# EAGLE design ttl-nixie-clock-generator (EAGLE 7.3.0)
CNAME: random_hw; CREVISION: v0.1; DESIGNER: nalajcie
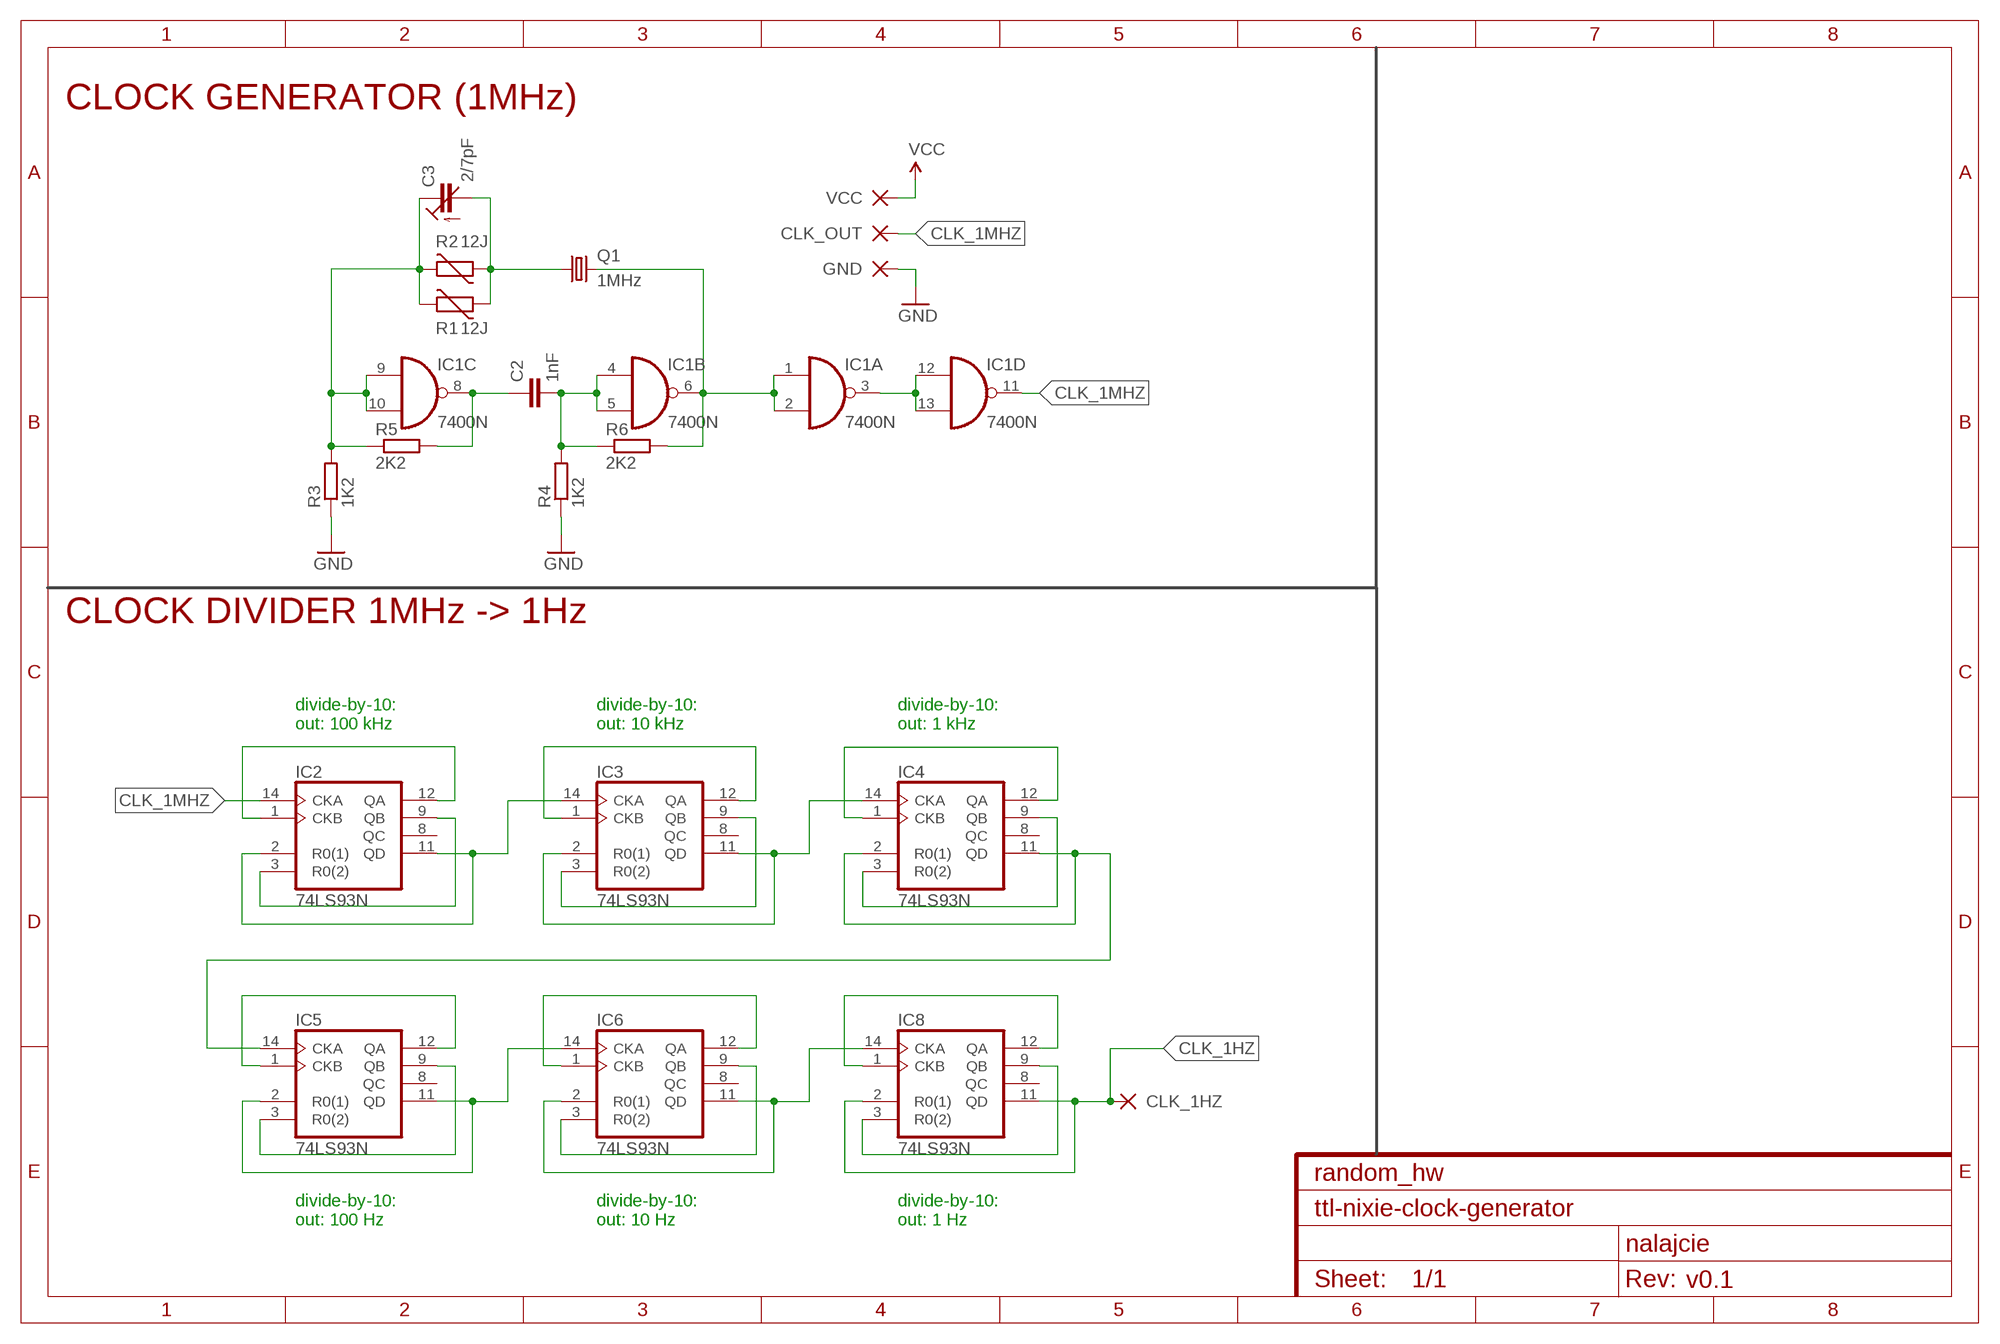
[diagram p0: schematic, sheet 1]

## Parts
C2  1nF  C15/5  [C15B5]
C3  2/7pF  C-TRIMM808-7.5  [CTRIM808-BC7.5]
CLK_1HZ  VCC  2,15/1,0  [2,15/1,0]
CLK_OUT  CLK_OUT  2,15/1,0  [2,15/1,0]
GND  GND  2,15/1,0  [2,15/1,0]
IC1  7400N  [DIL14]
IC2  74LS93N  [DIL14]
IC3  74LS93N  [DIL14]
IC4  74LS93N  [DIL14]
IC5  74LS93N  [DIL14]
IC6  74LS93N  [DIL14]
IC8  74LS93N  [DIL14]
Q1  1MHz  CRYSTALHC33U-V  [HC33U-V]
R1  12J  VARISTOR-7,5  [R-7,5]
R2  12J  VARISTOR-7,5  [R-7,5]
R3  1K2  R-EU_0207/12  [0207/12]
R4  1K2  R-EU_0207/12  [0207/12]
R5  2K2  R-EU_0207/12  [0207/12]
R6  2K2  R-EU_0207/12  [0207/12]
VCC  VCC  2,15/1,0  [2,15/1,0]

## Nets
CLK_1HZ: CLK_1HZ.1(P) IC8.2(R0(1)) IC8.11(QD)
CLK_1MHZ: CLK_OUT.1(P) IC1.11(D:O) IC2.14(CKA)
GND: GND.1(P) R3.1 R4.1
N$1: C3.2(A) Q1.1 R1.1 R2.1
N$2: C3.1(E) IC1.9(C:I0) IC1.10(C:I1) R1.2 R2.2 R3.2 R5.1
N$3: IC1.3(A:O) IC1.12(D:I0) IC1.13(D:I1)
N$4: C2.1 IC1.8(C:O) R5.2
N$5: C2.2 IC1.4(B:I0) IC1.5(B:I1) R4.2 R6.1
N$6: IC1.1(A:I0) IC1.2(A:I1) IC1.6(B:O) Q1.2 R6.2
N$8: IC5.1(CKB) IC5.12(QA)
N$9: IC5.3(R0(2)) IC5.9(QB)
N$10: IC5.2(R0(1)) IC5.11(QD) IC6.14(CKA)
N$11: IC6.1(CKB) IC6.12(QA)
N$12: IC6.3(R0(2)) IC6.9(QB)
N$13: IC6.2(R0(1)) IC6.11(QD) IC8.14(CKA)
N$14: IC8.1(CKB) IC8.12(QA)
N$15: IC8.3(R0(2)) IC8.9(QB)
N$16: IC2.1(CKB) IC2.12(QA)
N$17: IC2.2(R0(1)) IC2.11(QD) IC3.14(CKA)
N$18: IC2.3(R0(2)) IC2.9(QB)
N$19: IC3.3(R0(2)) IC3.9(QB)
N$20: IC3.2(R0(1)) IC3.11(QD) IC4.14(CKA)
N$21: IC3.1(CKB) IC3.12(QA)
N$22: IC4.1(CKB) IC4.12(QA)
N$23: IC4.3(R0(2)) IC4.9(QB)
N$24: IC4.2(R0(1)) IC4.11(QD) IC5.14(CKA)
VCC: VCC.1(P)
Unconnected: IC2.8(QC) IC3.8(QC) IC4.8(QC) IC5.8(QC) IC6.8(QC) IC8.8(QC)

## Notes on the sheet
- CLOCK GENERATOR (1MHz)
- CLOCK DIVIDER 1MHz -> 1Hz
- divide-by-10:
  out: 100 kHz
- divide-by-10:
  out: 10 kHz
- divide-by-10:
  out: 1 kHz
- divide-by-10:
  out: 100 Hz
- divide-by-10:
  out: 10 Hz
- divide-by-10:
  out: 1 Hz

## Power pins joined to a net without a drawn wire
GND: IC1.7(P:GND) IC2.10(GND) IC3.10(GND) IC4.10(GND) IC5.10(GND) IC6.10(GND) IC8.10(GND)
VCC: IC1.14(P:VCC) IC2.5(VCC) IC3.5(VCC) IC4.5(VCC) IC5.5(VCC) IC6.5(VCC) IC8.5(VCC)

## Library data of the parts
C2 = capacitor-wima:C: CAPACITOR naming: grid - package width
C3 = resistor:C-TRIMM: Trimm capacitor
CLK_1HZ CLK_OUT GND VCC = wirepad:2,15/1,0: THROUGH-HOLE PAD
IC1 = 74xx-eu:74*00: Quad 2-input NAND gate
IC2-IC6 IC8 = 74xx-eu:74*93: Decade, divide by twelve and binary COUNTER
Q1 = crystal:CRYSTAL: CRYSTAL; OC_FARNELL: unknown; OC_NEWARK: unknown
R1 R2 = varistor:VARISTOR: VARISTOR
R3-R6 = resistor:R-EU_: RESISTOR, European symbol

## Board
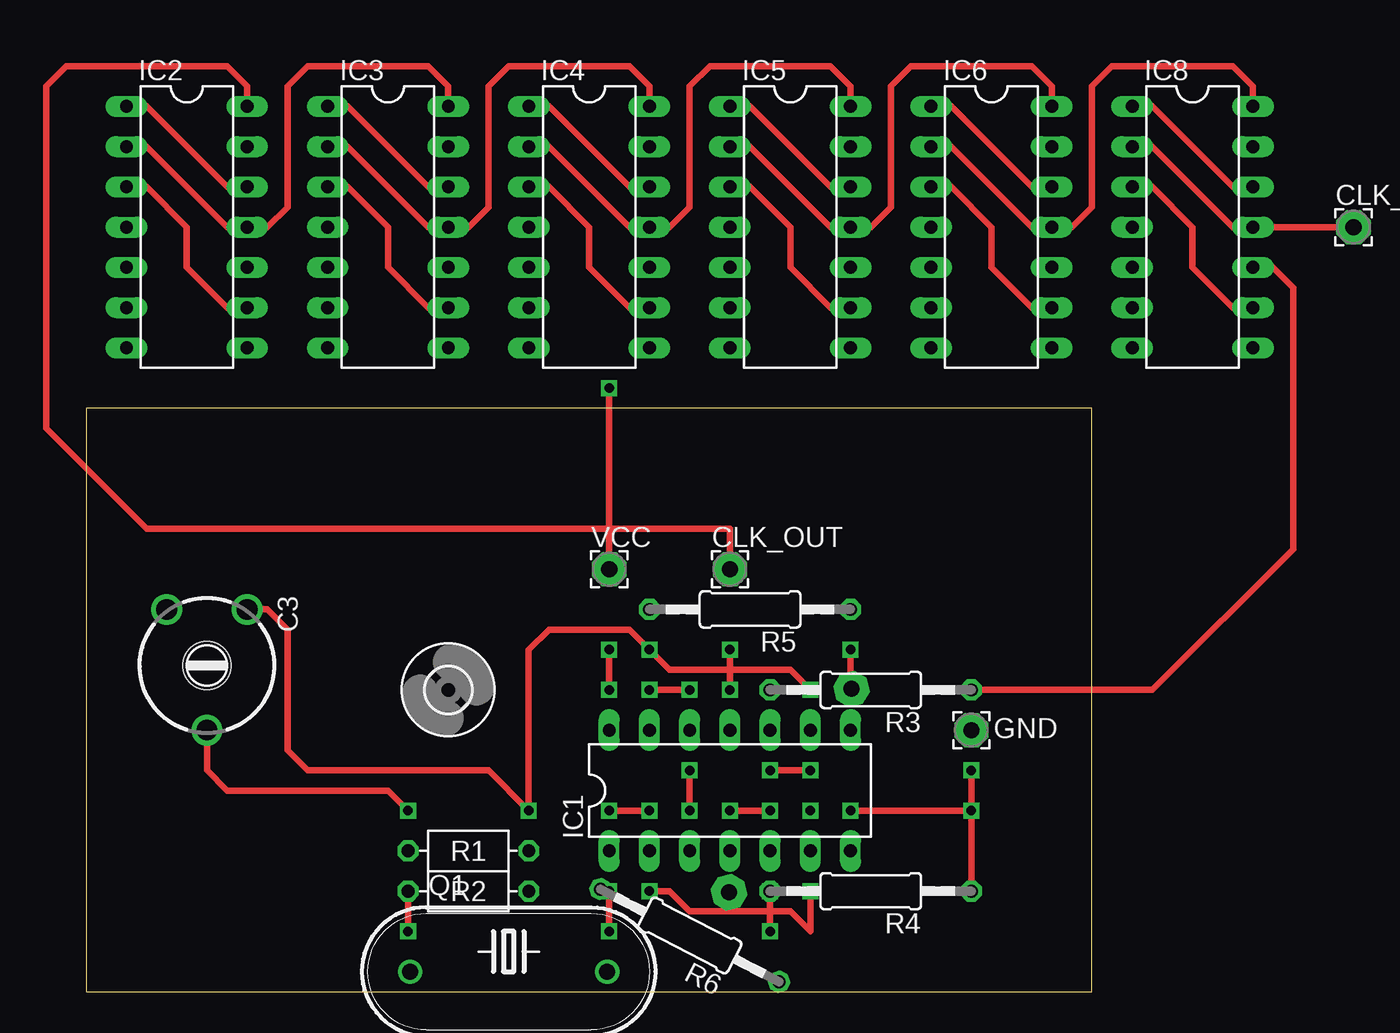
[diagram p1: board, top side]
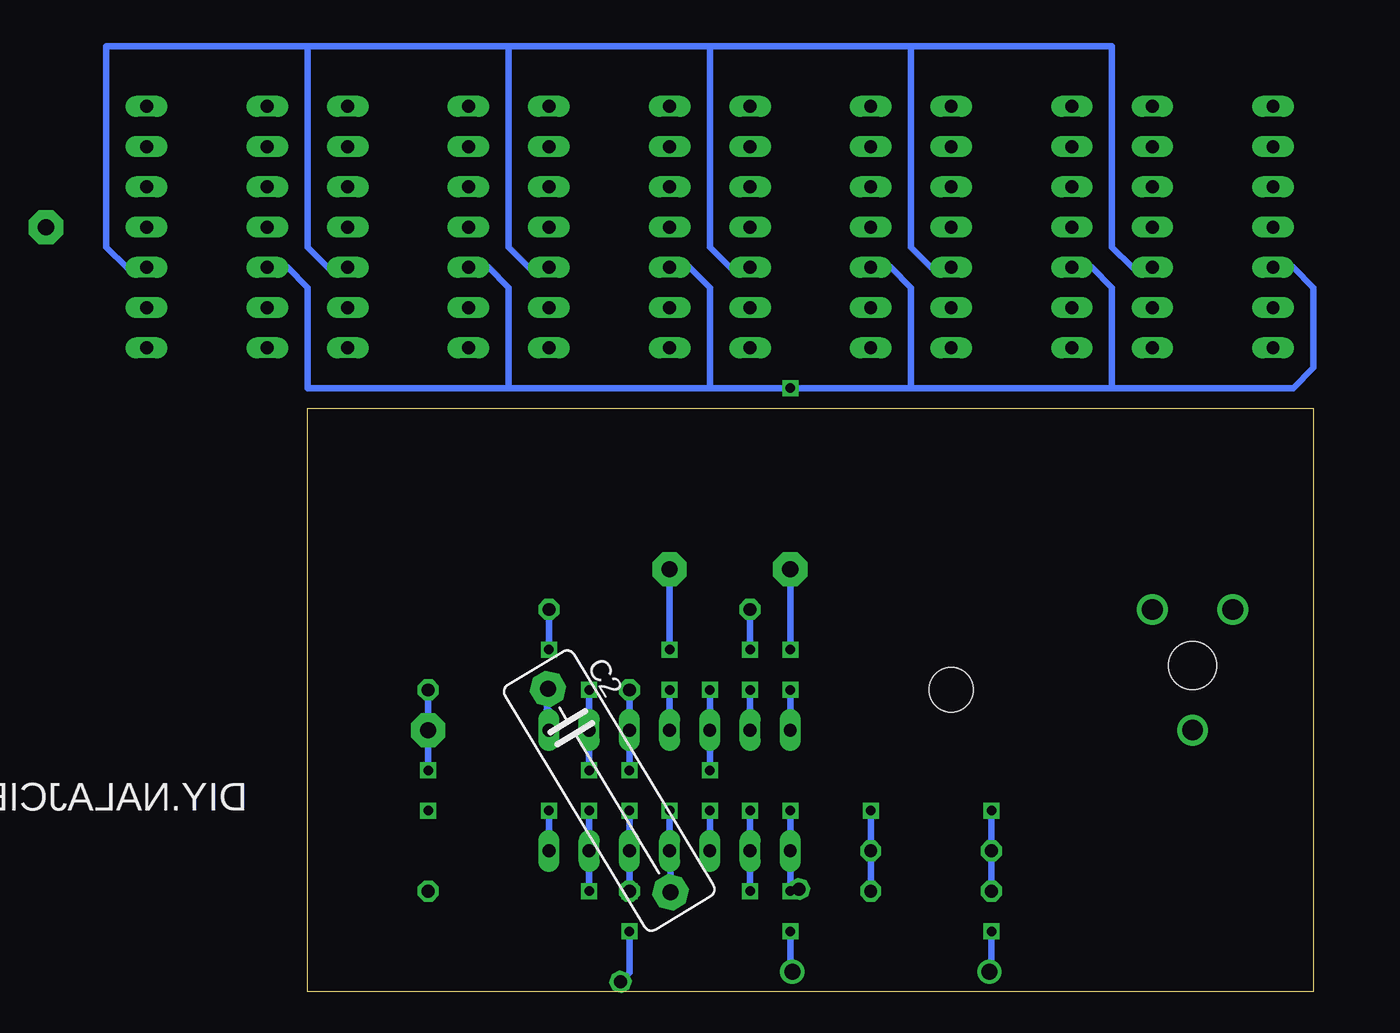
[diagram p2: board, bottom side, seen from below]

Size 63.5 x 36.83 mm. Coordinates in mm from the lower left corner, seen from the top.
Outline: 0,0 63.5,0 63.5,36.83 0,36.82 0,0
Copper layers (1*16): Top 0.035mm / dielectric 1.5mm / Bottom 0.035mm
Design rules "default": minimum track width 10mil, minimum drill 24mil, track to track 8mil, track to pad 8mil, pad to pad 8mil, via to via 8mil, smd to smd 8mil, copper to edge 40mil, drill to drill 8mil, minimum pad ring 10mil, minimum via ring 8mil, stop-mask expansion 4mil, vias tented up to drill 0mil, thermal gap 10mil

### Footprints (pad centres in the part's own frame; a part is rotated, then mirrored left to right if it is on the bottom)
C15B5 = drill 1.016 pad 2.159 octagon: 1 -7.493,0; 2 7.493,0
CTRIM808-BC7.5 = drill 1.3: 1 -2.54,-2.54; 2 0,5.08; 3 2.54,-2.54 | hole 3: 0,1
2,15/1,0 = drill 1.016 pad 2.159 octagon: 1 0,0
DIL14 = drill 0.813 long: 1 -7.62,-3.81; 2 -5.08,-3.81; 3 -2.54,-3.81; 4 0,-3.81; 5 2.54,-3.81; 6 5.08,-3.81; 7 7.62,-3.81; 8 7.62,3.81; 9 5.08,3.81; 10 2.54,3.81; 11 0,3.81; 12 -2.54,3.81; 13 -5.08,3.81; 14 -7.62,3.81
HC33U-V = drill 1.016: 1 -6.223,0; 2 6.223,0
R-7,5 = drill 0.813 octagon: 1 -3.81,0; 2 3.81,0
0207/12 = drill 0.813 octagon: 1 -6.35,0; 2 6.35,0
2,8 = hole 2.8: 0,0

### Placement (x,y rotation side)
C2  44.45,12.7 301.1 bottom
C3  7.62,21.59 180 top
CLK_1HZ  80.01,48.26 0 top  (outside the outline)
CLK_OUT  40.64,26.67 0 top
GND  55.88,16.51 0 top
IC1  40.64,12.7 0 top
IC2  6.35,48.26 270 top  (outside the outline)
IC3  19.05,48.26 270 top  (outside the outline)
IC4  31.75,48.26 270 top  (outside the outline)
IC5  44.45,48.26 270 top  (outside the outline)
IC6  57.15,48.26 270 top  (outside the outline)
IC8  69.85,48.26 270 top  (outside the outline)
Q1  26.67,1.27 0 top
R1  24.13,8.89 0 top
R2  24.13,6.35 0 top
R3  49.53,19.05 180 top
R4  49.53,6.35 180 top
R5  41.91,24.13 0 top
R6  38.1,3.56 152.6 top
U$1  [2,8]  22.86,19.05 0 top
VCC  33.02,26.67 0 top

### Tracks (layer width: path | path; a pad name or v marks a point on that pad's centre or on a via)
CLK_1HZ
  Top 0.406: IC8.2 67.31,53.34 72.39,48.26 IC8.11 CLK_1HZ.1
CLK_1MHZ  (via drill 0.6)
  Top 0.406: v40.64,19.05 v40.64,21.59 | CLK_OUT.1 40.64,29.21 3.81,29.21 -2.54,35.56 -2.54,57.15 -1.27,58.42 8.89,58.42 10.16,57.15 IC2.14
  Bottom 0.406: v40.64,21.59 CLK_OUT.1 | v40.64,19.05 IC1.11
GND  (via drill 0.6)
  Top 0.406: v55.88,11.43 v55.88,13.97 | R4.1 v55.88,11.43 | v55.88,11.43 v48.26,11.43 | R3.1 67.31,19.05 76.2,27.94 76.2,44.45 74.93,45.72 IC8.10
  Bottom 0.406: R3.1 GND.1 v55.88,13.97 | v48.26,11.43 IC1.7 | IC2.10 11.43,45.72 12.7,46.99 12.7,59.69 25.4,59.69 | 25.4,59.69 25.4,46.99 24.13,45.72 IC3.10 | IC4.10 36.83,45.72 38.1,46.99 38.1,59.69 | 38.1,59.69 25.4,59.69 | IC5.10 49.53,45.72 50.8,46.99 50.8,59.69 | 50.8,59.69 38.1,59.69 | IC6.10 62.23,45.72 63.5,46.99 63.5,59.69 | 63.5,59.69 50.8,59.69 | IC8.10 74.93,45.72 76.2,46.99 76.2,59.69 63.5,59.69
N$1  (via drill 0.6)
  Top 0.406: v20.32,3.81 R2.1 | v20.32,11.43 19.05,12.7 8.89,12.7 7.62,13.97 C3.2
  Bottom 0.406: Q1.1 20.32,1.4 v20.32,3.81 | R2.1 R1.1 v20.32,11.43
N$2  (via drill 0.6)
  Top 0.406: v43.18,13.97 v45.72,13.97 | v45.72,19.05 44.45,20.32 36.83,20.32 v35.56,21.59 34.29,22.86 29.21,22.86 27.94,21.59 v27.94,11.43 25.4,13.97 13.97,13.97 12.7,15.24 12.7,22.86 11.43,24.13 C3.1
  Bottom 0.406: R3.2 IC1.10 v43.18,13.97 | v45.72,13.97 IC1.9 v45.72,19.05 | R5.1 v35.56,21.59 | R2.2 R1.2 v27.94,11.43
N$3  (via drill 0.6)
  Top 0.406: v38.1,13.97 v38.1,11.43 | v38.1,19.05 v35.56,19.05
  Bottom 0.406: v38.1,13.97 IC1.12 v38.1,19.05 | v38.1,11.43 IC1.3 | v35.56,19.05 IC1.13
N$4  (via drill 0.6)
  Top 0.406: v48.26,19.05 v48.26,21.59
  Bottom 0.406: IC1.8 48.26,17.78 48.42,17.62 C2.1 48.26,18.13 v48.26,19.05 | v48.26,21.59 R5.2
N$5  (via drill 0.6)
  Top 0.406: v40.64,11.43 v43.18,11.43 | R4.2 v43.18,3.81
  Bottom 0.406: R6.1 43.18,1.19 43.18,1.27 v43.18,3.81 | v40.64,11.43 IC1.4 40.58,8.83 C2.2 | v43.18,11.43 IC1.5 R4.2
  other vias: 43.18,6.35
N$6  (via drill 0.6)
  Top 0.406: v33.02,11.43 v35.56,11.43 | v33.02,3.81 v33.02,6.35 | v45.72,6.35 45.72,3.81 44.45,5.08 38.1,5.08 36.83,6.35 v35.56,6.35
  Bottom 0.406: v33.02,11.43 IC1.1 v33.02,6.35 32.89,6.48 R6.2 | Q1.2 33.02,1.4 v33.02,3.81 | IC1.2 v35.56,11.43 v35.56,6.35 | v45.72,11.43 IC1.6 v45.72,6.35
N$8
  Top 0.406: IC5.12 46.99,50.8 41.91,55.88 IC5.1
N$9
  Top 0.406: IC5.9 46.99,43.18 44.45,45.72 44.45,48.26 41.91,50.8 IC5.3
N$10
  Top 0.406: IC6.14 60.96,57.15 59.69,58.42 52.07,58.42 50.8,57.15 50.8,49.53 49.53,48.26 IC5.11 46.99,48.26 41.91,53.34 IC5.2
N$11
  Top 0.406: IC6.12 59.69,50.8 54.61,55.88 IC6.1
N$12
  Top 0.406: IC6.9 59.69,43.18 57.15,45.72 57.15,48.26 54.61,50.8 IC6.3
N$13
  Top 0.406: IC8.14 73.66,57.15 72.39,58.42 64.77,58.42 63.5,57.15 63.5,49.53 62.23,48.26 IC6.11 59.69,48.26 54.61,53.34 IC6.2
N$14
  Top 0.406: IC8.12 72.39,50.8 67.31,55.88 IC8.1
N$15
  Top 0.406: IC8.9 72.39,43.18 69.85,45.72 69.85,48.26 67.31,50.8 IC8.3
N$16
  Top 0.406: IC2.12 8.89,50.8 3.81,55.88 IC2.1
N$17
  Top 0.406: IC3.14 22.86,57.15 21.59,58.42 13.97,58.42 12.7,57.15 12.7,49.53 11.43,48.26 IC2.11 8.89,48.26 3.81,53.34 IC2.2
N$18
  Top 0.406: IC2.9 8.89,43.18 6.35,45.72 6.35,48.26 3.81,50.8 IC2.3
N$19
  Top 0.406: IC3.9 21.59,43.18 19.05,45.72 19.05,48.26 16.51,50.8 IC3.3
N$20
  Top 0.406: IC4.14 35.56,57.15 34.29,58.42 26.67,58.42 25.4,57.15 25.4,49.53 24.13,48.26 IC3.11 21.59,48.26 16.51,53.34 IC3.2
N$21
  Top 0.406: IC3.12 21.59,50.8 16.51,55.88 IC3.1
N$22
  Top 0.406: IC4.12 34.29,50.8 29.21,55.88 IC4.1
N$23
  Top 0.406: IC4.9 34.29,43.18 31.75,45.72 31.75,48.26 29.21,50.8 IC4.3
N$24
  Top 0.406: IC5.14 48.26,57.15 46.99,58.42 39.37,58.42 38.1,57.15 38.1,49.53 36.83,48.26 IC4.11 34.29,48.26 29.21,53.34 IC4.2
VCC  (via drill 0.6)
  Top 0.406: v33.02,19.05 v33.02,21.59 | VCC.1 v33.02,38.1
  Bottom 0.406: IC1.14 v33.02,19.05 | v33.02,21.59 VCC.1 | IC2.5 1.27,45.72 0,44.45 0,39.37 1.27,38.1 12.7,38.1 | 12.7,38.1 12.7,44.45 13.97,45.72 IC3.5 | IC4.5 26.67,45.72 25.4,44.45 25.4,38.1 | 25.4,38.1 12.7,38.1 | IC5.5 39.37,45.72 38.1,44.45 38.1,38.1 | 25.4,38.1 v33.02,38.1 38.1,38.1 | IC6.5 52.07,45.72 50.8,44.45 50.8,38.1 | 50.8,38.1 38.1,38.1 | IC8.5 64.77,45.72 63.5,44.45 63.5,38.1 50.8,38.1

### Text on the board
Top: we're constructing only the 1MHz generator / (the board contents) / the divider circuit added just for the referece
bNames: DIY.NALAJCIE.ORG